# Altium schematic sheet 自动灌溉.SchDoc
size A4
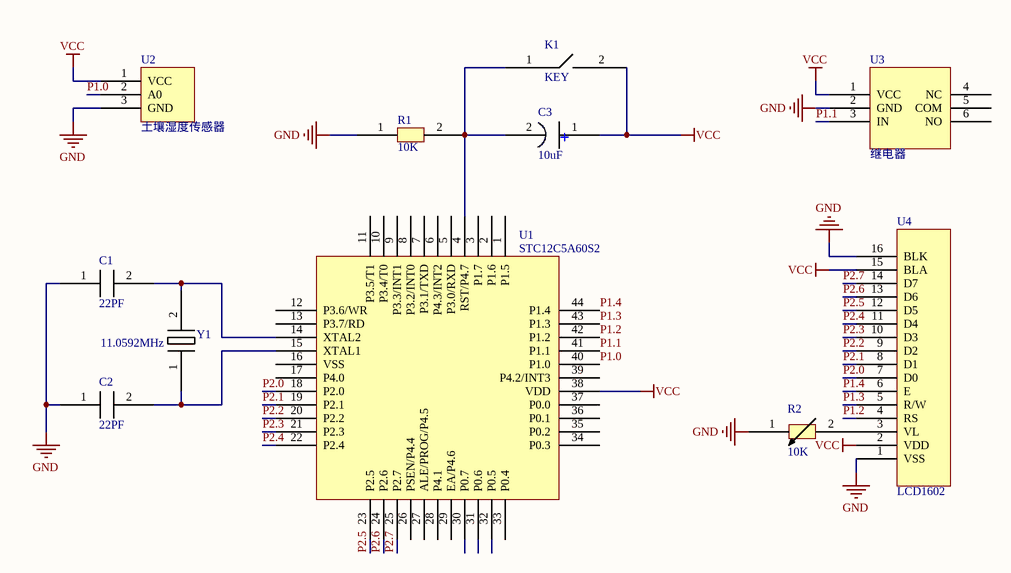
[diagram p0: 自动灌溉.SchDoc]

## Parts
C1  22PF
C2  22PF
C3  10uF
K1  KEY
R1  10K
R2  10K
U1  STC12C5A60S2
U2  土壤湿度传感器
U3  继电器
U4  LCD1602
Y1  11.0592MHz

## Nets
GND: C1.1 C2.1 R1.1 R2.1 U2.3(GND) U3.2(GND) U4.1(VSS) U4.16(BLK)
VCC: C3.1 K1.2 U1.38(VDD) U2.1(VCC) U3.1(VCC) U4.2(VDD) U4.15(BLA)
P1.0: U1.40(P1.0) U2.2(A0)
P1.1: U1.41(P1.1) U3.3(IN)
P1.2: U1.42(P1.2) U4.4(RS)
P1.3: U1.43(P1.3) U4.5(R/W)
P1.4: U1.44(P1.4) U4.6(E)
P2.0: U1.18(P2.0) U4.7(D0)
P2.1: U1.19(P2.1) U4.8(D1)
P2.2: U1.20(P2.2) U4.9(D2)
P2.3: U1.21(P2.3) U4.10(D3)
P2.4: U1.22(P2.4) U4.11(D4)
P2.5: U1.23(P2.5) U4.12(D5)
P2.6: U1.24(P2.6) U4.13(D6)
P2.7: U1.25(P2.7) U4.14(D7)
NetC1_2: C1.2 U1.14(XTAL2) Y1.2
NetC2_2: C2.2 U1.15(XTAL1) Y1.1
NetC3_2: C3.2 K1.1 R1.2 U1.4(RST/P4.7)
NetR2_2: R2.2 U4.3(VL)

Not connected (* = marked no-connect by the designer): U1 1(P1.5) 2(P1.6) 3(P1.7) 5(P3.0/RXD) 6(P4.3/INT2) 7(P3.1/TXD) 8(P3.2/INT0) 9(P3.3/INT1) 10(P3.4/T0) 11(P3.5/T1) 12(P3.6/WR) 13(P3.7/RD) 16(VSS) 17(P4.0) 26(PSEN/P4.4) 27(ALE/PROG/P4.5) 28(P4.1) 29(EA/P4.6) 30(P0.7) 31(P0.6) 32(P0.5) 33(P0.4) 34(P0.3) 35(P0.2) 36(P0.1) 37(P0.0) 39(P4.2/INT3); U3 4(NC) 5(COM) 6(NO)

## Notes on the sheet
- (near C3) +

## Library data of the parts
C1 C2 = CAP
C3 = CAP2
R1 = RES
R2 = 滑动变阻器
Y1 = 晶振